# Altium schematic sheet mppt_interface_ch0.SchDoc: MPPT Interface CH0
size A3; Date: 2015-10-14; Author: Piotr Kuligowski; Revision: 1-0; SheetNumber: 8; SheetTotal: 8; Model: EM1
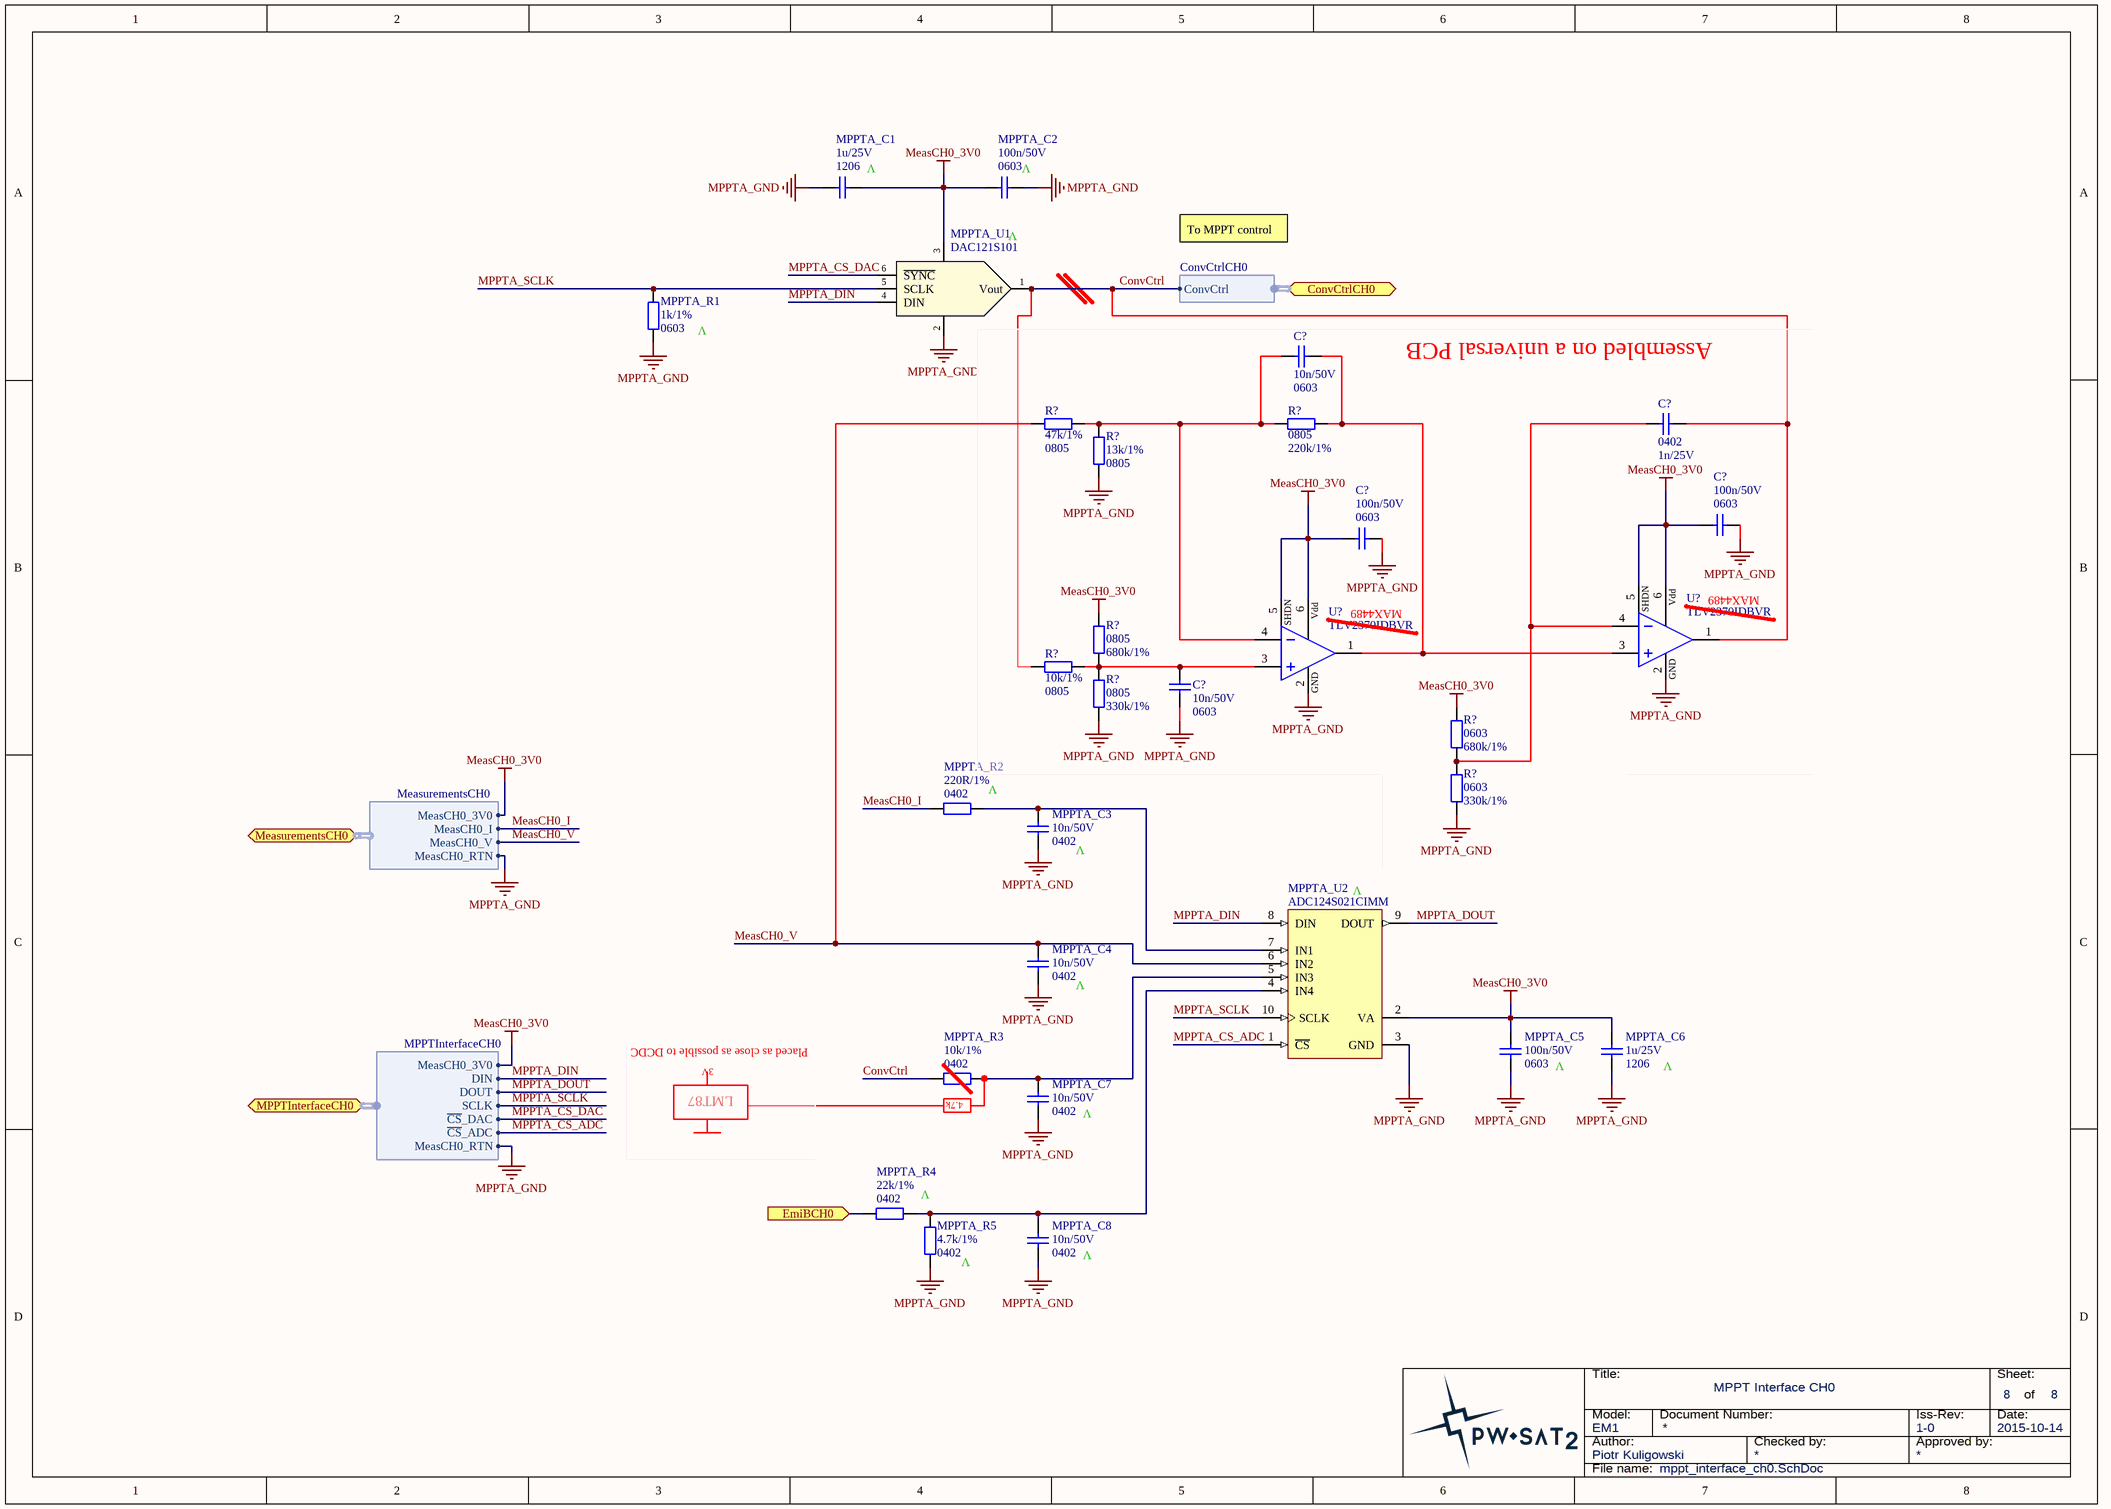
[diagram p0: mppt_interface_ch0.SchDoc]

## Parts
(Parts that share a designator on the sheet are numbered #1, #2 ... from top to bottom, then left to right.)
C?#1  Package: 0603  [SMD_Capacitor_0603]  (hidden comment: 10n/50V)
C?#2  Package: 0402  [SMD_Capacitor_0402]  (hidden comment: 1n/25V)
C?#3  Package: 0603  [SMD_Capacitor_0603]  (hidden comment: 100n/50V)
C?#4  Package: 0603  [SMD_Capacitor_0603]  (hidden comment: 100n/50V)
C?#5  Package: 0603  [SMD_Capacitor_0603]  (hidden comment: 10n/50V)
MPPTA_C1  Package: 1206  [SMD_Capacitor_1206]  (hidden comment: 1u/25V)
MPPTA_C2  Package: 0603  [SMD_Capacitor_0603]  (hidden comment: 100n/50V)
MPPTA_C3  Package: 0402  [SMD_Capacitor_0402]  (hidden comment: 10n/50V)
MPPTA_C4  Package: 0402  [SMD_Capacitor_0402]  (hidden comment: 10n/50V)
MPPTA_C5  Package: 0603  [SMD_Capacitor_0603]  (hidden comment: 100n/50V)
MPPTA_C6  Package: 1206  [SMD_Capacitor_1206]  (hidden comment: 1u/25V)
MPPTA_C7  Package: 0402  [SMD_Capacitor_0402]  (hidden comment: 10n/50V)
MPPTA_C8  Package: 0402  [SMD_Capacitor_0402]  (hidden comment: 10n/50V)
MPPTA_R1  Package: 0603  [SMD_Resistor_0603]  (hidden comment: 1k/1%)
MPPTA_R2  Package: 0402  [SMD_Resistor_0402]  (hidden comment: 220R/1%)
MPPTA_R3  Package: 0402  [SMD_Resistor_0402]  (hidden comment: 10k/1%)
MPPTA_R4  Package: 0402  [SMD_Resistor_0402]  (hidden comment: 22k/1%)
MPPTA_R5  Package: 0402  [SMD_Resistor_0402]  (hidden comment: 4.7k/1%)
MPPTA_U1  DAC121S101  [SOT23-6]
MPPTA_U2  ADC124S021CIMM  [MUB10A_L]
R?#1  Package: 0805  [SMD_Resistor_0805]  (hidden comment: 47k/1%)
R?#2  Package: 0805  [SMD_Resistor_0805]  (hidden comment: 220k/1%)
R?#3  Package: 0805  [SMD_Resistor_0805]  (hidden comment: 13k/1%)
R?#4  Package: 0805  [SMD_Resistor_0805]  (hidden comment: 680k/1%)
R?#5  Package: 0805  [SMD_Resistor_0805]  (hidden comment: 10k/1%)
R?#6  Package: 0805  [SMD_Resistor_0805]  (hidden comment: 330k/1%)
R?#7  Package: 0603  [SMD_Resistor_0603]  (hidden comment: 680k/1%)
R?#8  Package: 0603  [SMD_Resistor_0603]  (hidden comment: 330k/1%)
U?#1  (no value)  [SOT23-6]
U?#2  (no value)  [SOT23-6]

## Blocks framed on the sheet
Assembled on a universal PCB: C?#1-C?#5 R?#1-R?#7 U?#1 U?#2

## Ports
ConvCtrlCH0 (harness ConvCtrlCH0), EmiBCH0 (in), MeasurementsCH0 (harness MeasurementsCH0), MPPTInterfaceCH0 (harness MPPTInterfaceCH0)

## Harnesses
MeasurementsCH0: MeasCH0_RTN, MeasCH0_V, MeasCH0_I, MeasCH0_3V0
ConvCtrlCH0: ConvCtrl
MPPTInterfaceCH0: DIN, DOUT, SCLK, ~{CS}_DAC, ~{CS}_ADC, MeasCH0_3V0, MeasCH0_RTN

## Nets
MeasCH0_3V0: C?#3.1 C?#4.1 MPPTA_C1.2 MPPTA_C2.2 MPPTA_C5.1 MPPTA_C6.1 MPPTA_U1.3(Va) MPPTA_U2.2(VA) R?#4.1 R?#7.1 U?#1.5(SHDN) U?#1.6(Vdd) U?#2.5(SHDN) U?#2.6(Vdd) ; port MeasurementsCH0.MeasCH0_3V0, port MPPTInterfaceCH0.MeasCH0_3V0
MPPTA_GND: C?#3.2 C?#4.2 C?#5.1 MPPTA_C1.1 MPPTA_C2.1 MPPTA_C3.2 MPPTA_C4.2 MPPTA_C5.2 MPPTA_C6.2 MPPTA_C7.2 MPPTA_C8.2 MPPTA_R1.2 MPPTA_R5.2 MPPTA_U1.2(GND) MPPTA_U2.3(GND) R?#3.1 R?#6.2 R?#8.2 U?#1.2(GND) U?#2.2(GND) ; port MeasurementsCH0.MeasCH0_RTN, port MPPTInterfaceCH0.MeasCH0_RTN
ConvCtrl: C?#2.2 MPPTA_R3.1 MPPTA_U1.1(Vout) R?#5.1 U?#1.1(OUT) ; port ConvCtrlCH0.ConvCtrl
EmiBCH0: MPPTA_R4.1 ; port EmiBCH0
MeasCH0_I: MPPTA_R2.1 ; port MeasurementsCH0.MeasCH0_I
MeasCH0_V: MPPTA_C4.1 MPPTA_U2.6(IN2) R?#1.1 ; port MeasurementsCH0.MeasCH0_V
MPPTA_CS_ADC: MPPTA_U2.1(~{CS}) ; port MPPTInterfaceCH0.~{CS}_ADC
MPPTA_CS_DAC: MPPTA_U1.6(~{SYNC}) ; port MPPTInterfaceCH0.~{CS}_DAC
MPPTA_DIN: MPPTA_U1.4(DIN) MPPTA_U2.8(DIN) ; port MPPTInterfaceCH0.DIN
MPPTA_DOUT: MPPTA_U2.9(DOUT) ; port MPPTInterfaceCH0.DOUT
MPPTA_SCLK: MPPTA_R1.1 MPPTA_U1.5(SCLK) MPPTA_U2.10(SCLK) ; port MPPTInterfaceCH0.SCLK
NetC?#1_1: C?#1.1 R?#1.2 R?#2.1 R?#3.2 U?#2.4(IN-)
NetC?#1_2: C?#1.2 R?#2.2 U?#1.3(IN+) U?#2.1(OUT)
NetC?#2_1: C?#2.1 R?#7.2 R?#8.1 U?#1.4(IN-)
NetC?#5_2: C?#5.2 R?#4.2 R?#5.2 R?#6.1 U?#2.3(IN+)
NetMPPTA_C3_1: MPPTA_C3.1 MPPTA_R2.2 MPPTA_U2.7(IN1)
NetMPPTA_C7_1: MPPTA_C7.1 MPPTA_R3.2 MPPTA_U2.5(IN3)
NetMPPTA_C8_1: MPPTA_C8.1 MPPTA_R4.2 MPPTA_R5.1 MPPTA_U2.4(IN4)

## Notes on the sheet
- (near MPPTA_C1) V
- (near MPPTA_C2) V
- (near MPPTA_U1) V
- To MPPT control
- V
- (near U?#1) MAX4489
- (near U?#2) MAX4489
- (near MPPTA_C3) V
- (near MPPTA_U2) V
- (near MPPTA_C4) V
- Placed as close as possible to DCDC
- 3V
- LMT87
- (near MPPTA_R3) 4.7k
- Title:
- Sheet:
- of
- Author:
- Model:
- Document Number:
- Checked by:
- Iss-Rev:
- Approved by:
- Date:
- File name:

## Library data of the parts
C?#1 C?#3-C?#5 MPPTA_C2 MPPTA_C5 = Cer_C0603T104K5RALTU: Ceramic Cap Kemet COTS 100n/50V X7R 0603; Manufacturer: Kemet; ManufacturerPartNumber: C0603T104K5RALTU
  C?#1 C?#5: Value: 10n/50V
  C?#3 C?#4 MPPTA_C2 MPPTA_C5: Value: 100n/50V
C?#2 = Cer_C0402T102K3GAL: Ceramic Cap Kemet COTS 1n/25V C0G 0402.; Manufacturer: Kemet; ManufacturerPartNumber: C0402T102K3GAL; Value: 1n/25V
MPPTA_C1 MPPTA_C6 = Cer_C1206T105K3RALTU: Ceramic Cap Kemet COTS 1u/25V X7R 1206; ManufacturerPartNumber: C1206T105K3RALTU; Manufacturer: Kemet; Value: 1u/25V
MPPTA_C3 MPPTA_C4 MPPTA_C7 MPPTA_C8 = Cer_C0402T103K5RALTU: Ceramic Cap Kemet COTS 10n/50V X7R 0402; ManufacturerPartNumber: C0402T103K5RALTU; Manufacturer: Kemet; Value: 10n/50V
MPPTA_R1 = CRCW06031K00FKxxxx: 1k/1% Vishay CRCW 0603 Resistor. 100mW, 100ppm, 75V.; Manufacturer: Vishay; ManufacturerPartNumber: CRCW06031K00FKxxxx; Value: 1k/1%
MPPTA_R2 = CRCW0402220RFKxxxx: 220R/1% Vishay CRCW 0402 Resistor. 63mW, 100ppm, 50V.; Manufacturer: Vishay; ManufacturerPartNumber: CRCW0402220RFKxxxx; Value: 220R/1%
MPPTA_R3 = CRCW040210K0FKxxxx: 10k/1% Vishay CRCW 0402 Resistor. 63mW, 100ppm, 50V.; Manufacturer: Vishay; ManufacturerPartNumber: CRCW040210K0FKxxxx; Value: 10k/1%
MPPTA_R4 = CRCW040222K0FKxxxx: 22k/1% Vishay CRCW 0402 Resistor. 63mW, 100ppm, 50V.; Manufacturer: Vishay; ManufacturerPartNumber: CRCW040222K0FKxxxx; Value: 22k/1%
MPPTA_R5 = CRCW04024K70FKxxxx: 4.7k/1% Vishay CRCW 0402 Resistor. 63mW, 100ppm, 50V.; ManufacturerPartNumber: CRCW04024K70FKxxxx; Manufacturer: Vishay; Value: 4.7k/1%
MPPTA_U1 = DAC121S101: 12-Bit Micro Power, RRO Digital-to-Analog Converter.; Manufacturer: Texas Instruments; Value: DAC121S101
MPPTA_U2 = ADC124S021CIMM/NOPB: Manufacturer: Texas Instruments; ManufacturerPartNumber: ADC124S021CIMM/NOPB; Value: ADC124S021CIMM
R?#1 R?#3 R?#5 = CRCW080510K0FKxxxx: 10k/1% Vishay CRCW 0805 Resistor. 125mW, 100ppm, 150V.; Manufacturer: Vishay; ManufacturerPartNumber: CRCW080510K0FKxxxx
  R?#1: Value: 47k/1%
  R?#3: Value: 13k/1%
  R?#5: Value: 10k/1%
R?#2 R?#4 R?#6 = CRCW0805220KFKxxxx: 220k/1% Vishay CRCW 0805 Resistor. 125mW, 100ppm, 150V.; ManufacturerPartNumber: CRCW0805220KFKxxxx; Manufacturer: Vishay
  R?#2: Value: 220k/1%
  R?#4: Value: 680k/1%
  R?#6: Value: 330k/1%
R?#7 = CRCW06032K20FKxxxx: 2.2k/1% Vishay CRCW 0603 Resistor. 100mW, 100ppm, 75V.; ManufacturerPartNumber: CRCW06032K20FKxxxx; Manufacturer: Vishay; Value: 680k/1%
R?#8 = CRCW06031K10FKxxxx: 1.1k/1% Vishay CRCW 0603 Resistor. 100mW, 100ppm, 75V.; ManufacturerPartNumber: CRCW06031K10FKxxxx; Manufacturer: Vishay; Value: 330k/1%
U?#1 U?#2 = TLV2370IDBVR: 3-MHz Rail-to-Rail In/Out Single Operational Amplifier; Manufacturer: Texas Instruments; HelpUrl: http://www.ti.com/lit/ds/symlink/tlv2370.pdf; ManufacturerPartNumber: TLV2370IDBVR